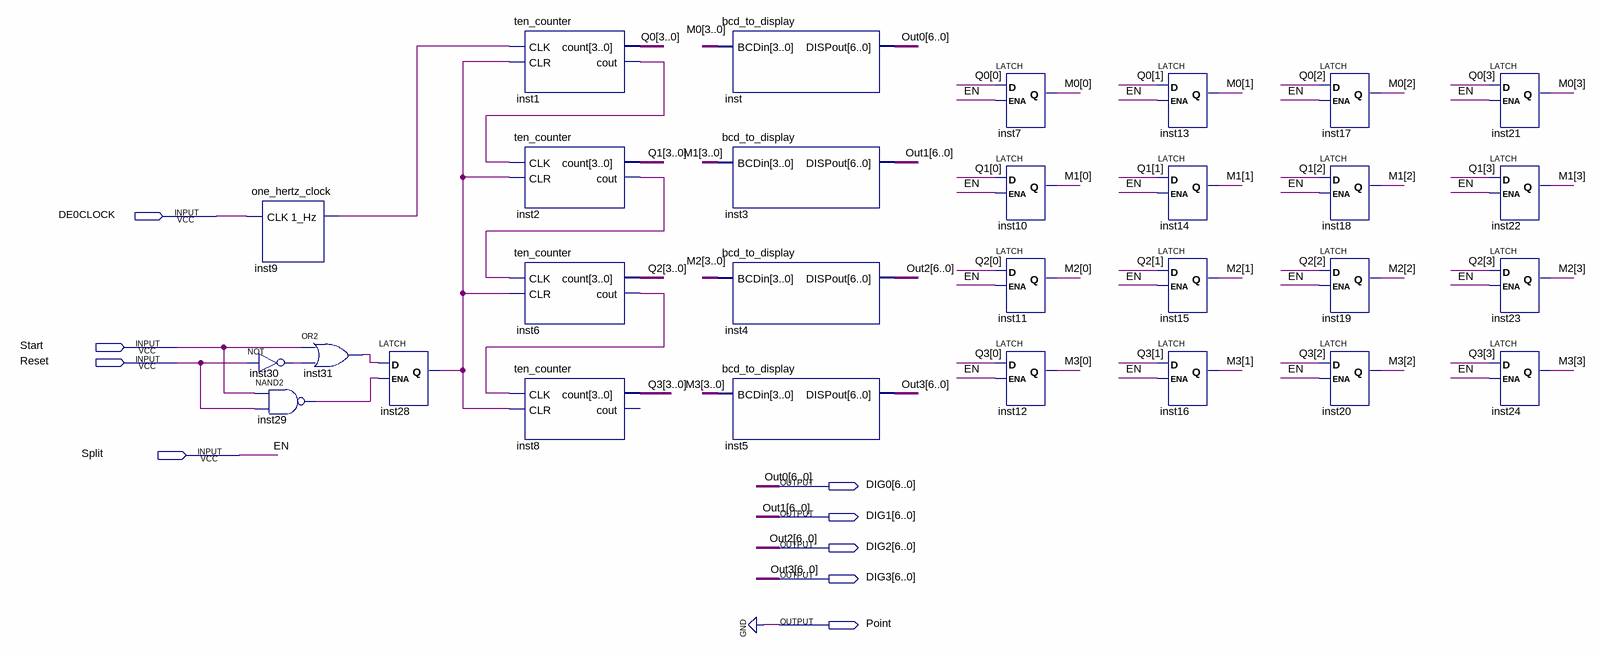
[diagram p0: schematic sheet]
// Quartus schematic stopwatch.bdf as structural Verilog: 29 symbols, 9 pins
module stopwatch (
  input  DE0CLOCK,
  input  Start,
  input  Reset,
  input  Split,
  output [6:0] DIG0,
  output [6:0] DIG1,
  output [6:0] DIG2,
  output [6:0] DIG3,
  output Point
);

  wire inst1_cout, inst2_cout, inst6_cout, inst9_1_hz, inst28_q, inst29_out, inst30_out, inst31_out;
  wire [3:0] M0, M1, M2, M3, Q0, Q1, Q2, Q3;

  one_hertz_clock inst9 (.CLK(DE0CLOCK), .\1_Hz (inst9_1_hz));
  not inst30 (inst30_out, Reset);
  nand inst29 (inst29_out, Start, Reset);
  or inst31 (inst31_out, Start, inst30_out);
  LATCH inst28 (.D(inst31_out), .ENA(inst29_out), .Q(inst28_q));
  ten_counter inst1 (.CLK(inst9_1_hz), .CLR(inst28_q), .count(Q0), .cout(inst1_cout));
  ten_counter inst2 (.CLK(inst1_cout), .CLR(inst28_q), .count(Q1), .cout(inst2_cout));
  ten_counter inst6 (.CLK(inst2_cout), .CLR(inst28_q), .count(Q2), .cout(inst6_cout));
  ten_counter inst8 (.CLK(inst6_cout), .CLR(inst28_q), .count(Q3));  // open: cout
  bcd_to_display inst (.BCDin(M0), .DISPout(DIG0));
  bcd_to_display inst3 (.BCDin(M1), .DISPout(DIG1));
  bcd_to_display inst4 (.BCDin(M2), .DISPout(DIG2));
  bcd_to_display inst5 (.BCDin(M3), .DISPout(DIG3));
  LATCH inst7 (.D(Q0[0]), .ENA(Split), .Q(M0[0]));
  LATCH inst10 (.D(Q1[0]), .ENA(Split), .Q(M1[0]));
  LATCH inst11 (.D(Q2[0]), .ENA(Split), .Q(M2[0]));
  LATCH inst12 (.D(Q3[0]), .ENA(Split), .Q(M3[0]));
  LATCH inst13 (.D(Q0[1]), .ENA(Split), .Q(M0[1]));
  LATCH inst14 (.D(Q1[1]), .ENA(Split), .Q(M1[1]));
  LATCH inst15 (.D(Q2[1]), .ENA(Split), .Q(M2[1]));
  LATCH inst16 (.D(Q3[1]), .ENA(Split), .Q(M3[1]));
  LATCH inst17 (.D(Q0[2]), .ENA(Split), .Q(M0[2]));
  LATCH inst18 (.D(Q1[2]), .ENA(Split), .Q(M1[2]));
  LATCH inst19 (.D(Q2[2]), .ENA(Split), .Q(M2[2]));
  LATCH inst20 (.D(Q3[2]), .ENA(Split), .Q(M3[2]));
  LATCH inst21 (.D(Q0[3]), .ENA(Split), .Q(M0[3]));
  LATCH inst22 (.D(Q1[3]), .ENA(Split), .Q(M1[3]));
  LATCH inst23 (.D(Q2[3]), .ENA(Split), .Q(M2[3]));
  LATCH inst24 (.D(Q3[3]), .ENA(Split), .Q(M3[3]));

  assign Point = 1'b0;

  // Other names for the same wires on the sheet: EN = Split; Out0[6:0] = DIG0; Out1[6:0] = DIG1; Out2[6:0] = DIG2;
  //   Out3[6:0] = DIG3
endmodule
